# Altium schematic sheet peripheral.SchDoc
size A4
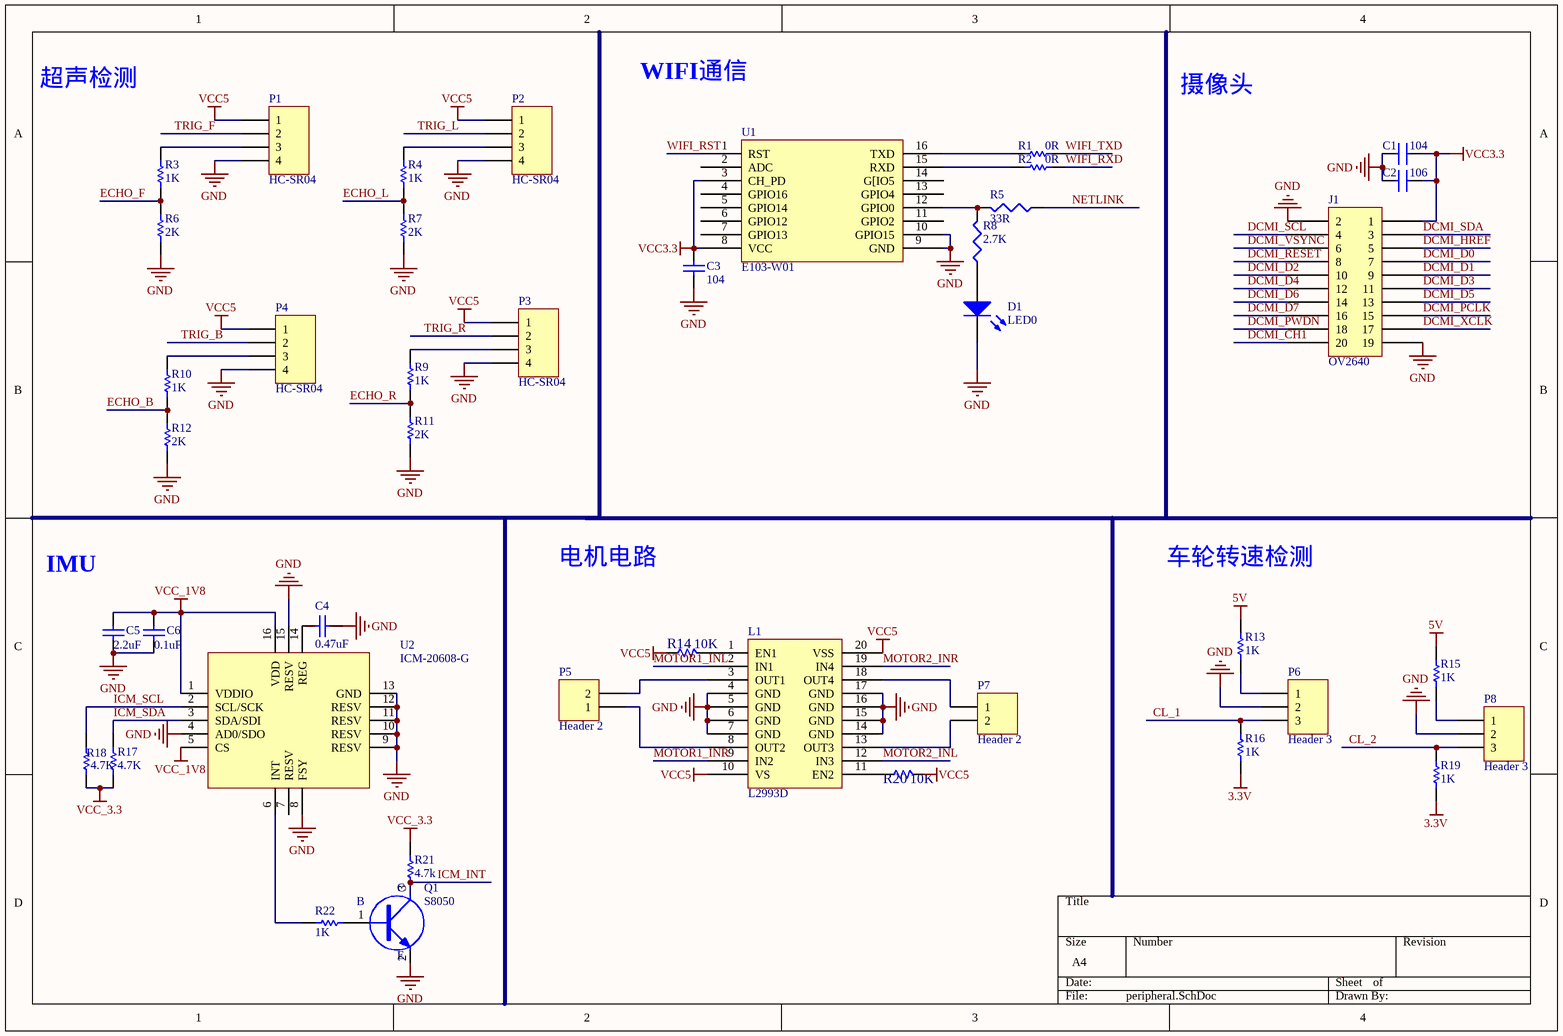
[diagram p0: peripheral.SchDoc]

## Parts
C1  104  [C0603]
C2  106  [C0603]
C3  104  [0603C]
C4  0.47uF  [0603C]
C5  2.2uF  [0603C]
C6  0.1uF  [0603C]
D1  LED0  [0603LED]
J1  OV2640
L1  L2993D
P1  HC-SR04  [HDR1X4]
P2  HC-SR04  [HDR1X4]
P3  HC-SR04  [HDR1X4]
P4  HC-SR04  [HDR1X4]
P5  Header 2  [HDR1X2]
P6  Header 3  [CON3]
P7  Header 2  [HDR1X2]
P8  Header 3  [CON3]
Q1  S8050  [SOT-23]
R1  0R  [0603R]
R2  0R  [0603R]
R3  1K  [0603C]
R4  1K  [0603C]
R5  33R  [0603R]
R6  2K  [0603C]
R7  2K  [0603C]
R8  2.7K  [0603R]
R9  1K  [0603C]
R10  1K  [0603C]
R11  2K  [0603C]
R12  2K  [0603C]
R13  1K  [0603C]
R14  10K  [R0603]
R15  1K  [0603C]
R16  1K  [0603C]
R17  4.7K  [0603C]
R18  4.7K  [0603C]
R19  1K  [0603C]
R20  10K  [R0603]
R21  4.7k  [0603C]
R22  1K  [0603C]
U1  E103-W01  [E103-W01]
U2  ICM-20608-G  [IC268G]

## Nets
3.3V: R16.1 R19.1
5V: R13.2 R15.2
GND: C1.1 C2.1 C3.1 C4.2 C5.1 C6.1 D1.2(K) J1.2 J1.19 L1.4(GND) L1.5(GND) L1.6(GND) L1.7(GND) L1.14(GND) L1.15(GND) L1.16(GND) L1.17(GND) P1.4 P2.4 P3.4 P4.4 P6.2 P8.2 Q1.2(E) R6.1 R7.1 R11.1 R12.1 U1.9(GND) U1.10(GPIO15) U2.4(AD0/SDO) U2.8(FSY) U2.9(RESV) U2.10(RESV) U2.11(RESV) U2.12(RESV) U2.13(GND) U2.15(RESV)
VCC3.3: C1.2 C2.2 C3.2 J1.1 U1.3(CH_PD) U1.8(VCC)
VCC5: L1.10(VS) L1.20(VSS) P1.1 P2.1 P3.1 P4.1 R14.1 R20.2
VCC_1V8: C5.2 C6.2 U2.1(VDDIO) U2.5(CS) U2.16(VDD)
VCC_3.3: R17.2 R18.1 R21.2
CL_1: P6.3 R16.2
CL_2: P8.3 R19.2
DCMI_CH1: J1.20
DCMI_D0: J1.7
DCMI_D1: J1.9
DCMI_D2: J1.10
DCMI_D3: J1.11
DCMI_D4: J1.12
DCMI_D5: J1.13
DCMI_D6: J1.14
DCMI_D7: J1.16
DCMI_HREF: J1.5
DCMI_PCLK: J1.15
DCMI_PWDN: J1.18
DCMI_RESET: J1.8
DCMI_SCL: J1.4
DCMI_SDA: J1.3
DCMI_VSYNC: J1.6
DCMI_XCLK: J1.17
ECHO_B: R10.1 R12.2
ECHO_F: R3.1 R6.2
ECHO_L: R4.1 R7.2
ECHO_R: R9.1 R11.2
ICM_INT: Q1.3(C) R21.1
ICM_SCL: R18.2 U2.2(SCL/SCK)
ICM_SDA: R17.1 U2.3(SDA/SDI)
MOTOR1_INL: L1.2(IN1)
MOTOR1_INR: L1.9(IN2)
MOTOR2_INL: L1.12(IN3)
MOTOR2_INR: L1.19(IN4)
NETLINK: R5.1
TRIG_B: P4.2
TRIG_F: P1.2
TRIG_L: P2.2
TRIG_R: P3.2
WIFI_RST: U1.1(RST)
WIFI_RXD: R2.2
WIFI_TXD: R1.2
NetC4_1: C4.1 U2.14(REG)
NetD1_1: D1.1(A) R8.1
NetL1_1: L1.1(EN1) R14.2
NetL1_3: L1.3(OUT1) P5.2
NetL1_8: L1.8(OUT2) P5.1
NetL1_11: L1.11(EN2) R20.1
NetL1_13: L1.13(OUT3) P7.2
NetL1_18: L1.18(OUT4) P7.1
NetP1_3: P1.3 R3.2
NetP2_3: P2.3 R4.2
NetP3_3: P3.3 R9.2
NetP4_3: P4.3 R10.2
NetP6_1: P6.1 R13.1
NetP8_1: P8.1 R15.1
NetQ1_1: Q1.1(B) R22.1
NetR1_1: R1.1 U1.16(TXD)
NetR2_1: R2.1 U1.15(RXD)
NetR5_2: R5.2 R8.2 U1.12(GPIO0)
NetR22_2: R22.2 U2.6(INT)

Not connected (* = marked no-connect by the designer): U1 2(ADC) 4(GPIO16) 5(GPIO14) 6(GPIO12) 7(GPIO13) 11(GPIO2) 13(GPIO4) 14(G[IO5); U2 7(RESV)

## Notes on the sheet
- 超声检测
- WIFI通信
- 摄像头
- IMU
- 电机电路
- 车轮转速检测

## Library data of the parts
C1 C2 = CAP_9: Capacitor; IC: *
C3-C6 = Cap_1: Capacitor; Published: 8-Jun-2000; LatestRevisionDate: 17-Jul-2002; LatestRevisionNote: Re-released for DXP Platform.; PackageReference: RAD-0.3; Publisher: Altium Limited
D1 = LED0: Typical INFRARED GaAs LED; Published: 8-Jun-2000; LatestRevisionDate: 08-Jul-2005; LatestRevisionNote: Mech Layer 1 removed.; PackageReference: LED-0; Publisher: Altium Limited; PackageDescription: LED; 2 Leads
P1-P4 = Header 4: Header, 4-Pin; LatestRevisionDate: 17-Jul-2002; LatestRevisionNote: Re-released for DXP Platform.; Publisher: Altium Limited
P5 P7 = Header 2_2: Header, 2-Pin; LatestRevisionDate: 17-Jul-2002; LatestRevisionNote: Re-released for DXP Platform.; Publisher: Altium Limited
P6 P8 = Header 3: Header, 3-Pin; LatestRevisionDate: 17-Jul-2002; LatestRevisionNote: Re-released for DXP Platform.; Publisher: Altium Limited
Q1 = NPN_1
R1 R2 = Res1_4: Resistor; Value: 1K; Published: 8-Jun-2000; LatestRevisionDate: 17-Jul-2002; LatestRevisionNote: Re-released for DXP Platform.; PackageReference: AXIAL-0.3; Publisher: Altium Limited
R3 R4 R9 R10 R13 R15 R16 R19 R22 = Res1: Resistor; Published: 8-Jun-2000; LatestRevisionDate: 17-Jul-2002; LatestRevisionNote: Re-released for DXP Platform.; PackageReference: AXIAL-0.3; Publisher: Altium Limited; Value: 1K
R5 R8 = RES1
R6 R7 R11 R12 R17 R18 R21 = Res1: Resistor; Value: 1K; Published: 8-Jun-2000; LatestRevisionDate: 17-Jul-2002; LatestRevisionNote: Re-released for DXP Platform.; PackageReference: AXIAL-0.3; Publisher: Altium Limited
R14 R20 = R_1: Resistor
U1 = E103-W01: Diode
U2 = DS-000081: Capacitor